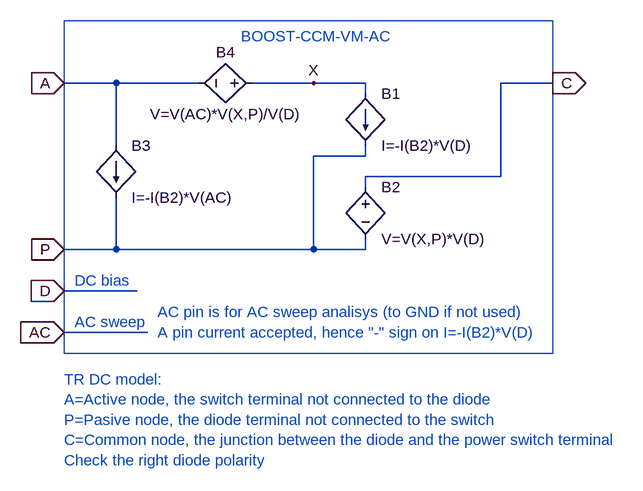
[diagram p0: schematic BOOST-CCM-VM-AC.asc]
BOOST-CCM-VM-AC.asc, the LTspice schematic file:
Version 4
SHEET 1 944 680
WIRE 32 32 -48 32
WIRE 160 32 32 32
WIRE 336 32 240 32
WIRE 416 32 336 32
WIRE 704 32 624 32
WIRE 416 48 416 32
WIRE 32 128 32 32
WIRE 416 144 416 128
WIRE 416 144 336 144
WIRE 624 176 624 32
WIRE 624 176 416 176
WIRE 416 192 416 176
WIRE 32 288 32 208
WIRE 32 288 -48 288
WIRE 336 288 336 144
WIRE 336 288 32 288
WIRE 416 288 416 272
WIRE 416 288 336 288
WIRE 64 352 -48 352
WIRE 80 416 -48 416
FLAG -48 32 A
IOPIN -48 32 In
FLAG -48 288 P
IOPIN -48 288 In
FLAG 704 32 C
IOPIN 704 32 Out
FLAG -48 352 D
IOPIN -48 352 In
FLAG -48 416 AC
IOPIN -48 416 In
FLAG 336 32 X
SYMBOL bi 416 48 R0
SYMATTR InstName B1
SYMATTR Value I=-I(B2)*V(D)
SYMBOL bv 416 176 R0
SYMATTR InstName B2
SYMATTR Value V=V(X,P)*V(D)
SYMBOL bv 256 32 R90
WINDOW 0 -32 56 VBottom 0
WINDOW 3 32 56 VTop 0
SYMATTR InstName B4
SYMATTR Value V=V(AC)*V(X,P)/V(D)
SYMBOL bi 32 128 R0
SYMATTR InstName B3
SYMATTR Value I=-I(B2)*V(AC)
TEXT 224 -40 Left 0 ;BOOST-CCM-VM-AC
TEXT 96 416 Left 0 ;A pin current accepted, hence "-" sign on I=-I(B2)*V(D)
TEXT -48 488 Left 0 ;TR DC model:\nA=Active node, the switch terminal not connected to the diode\nP=Pasive node, the diode terminal not connected to the switch\nC=Common node, the junction between the diode and the power switch terminal\nCheck the right diode polarity
TEXT -32 400 Left 0 ;AC sweep
TEXT -32 336 Left 0 ;DC bias
TEXT 96 384 Left 0 ;AC pin is for AC sweep analisys (to GND if not used)
RECTANGLE Normal 704 448 -48 -64

The netlist it stands for:
* BOOST-CCM-VM-AC.asc
B1 X P I=-I(B2)*V(D)
B2 C P V=V(X,P)*V(D)
B4 X A V=V(AC)*V(X,P)/V(D)
B3 A P I=-I(B2)*V(AC)
* BOOST-CCM-VM-AC
* A pin current accepted, hence "-" sign on I=-I(B2)*V(D)
* TR DC model:
* A=Active node, the switch terminal not connected to the diode
* P=Pasive node, the diode terminal not connected to the switch
* C=Common node, the junction between the diode and the power switch terminal
* Check the right diode polarity
* AC sweep
* DC bias
* AC pin is for AC sweep analisys (to GND if not used)
.backanno
.end